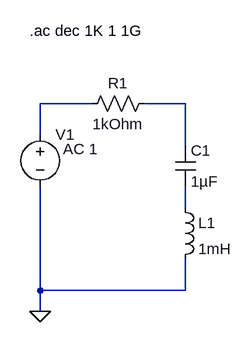
[diagram p0: schematic Draft1.asc]
Draft1.asc, the LTspice schematic file:
Version 4
SHEET 1 880 680
WIRE 288 240 208 240
WIRE 432 240 368 240
WIRE 208 288 208 240
WIRE 432 304 432 240
WIRE 432 400 432 368
WIRE 208 528 208 368
WIRE 432 528 432 480
WIRE 432 528 208 528
WIRE 208 560 208 528
FLAG 208 560 0
SYMBOL voltage 208 272 R0
WINDOW 123 35 38 Left 2
SYMATTR Value2 AC 1
SYMATTR InstName V1
SYMATTR Value ""
SYMBOL res 384 224 R90
WINDOW 0 0 56 VBottom 2
WINDOW 3 32 56 VTop 2
SYMATTR InstName R1
SYMATTR Value 1kOhm
SYMBOL cap 416 304 R0
SYMATTR InstName C1
SYMATTR Value 1µF
SYMBOL ind 416 384 R0
SYMATTR InstName L1
SYMATTR Value 1mH
TEXT 192 128 Left 2 !.ac dec 1K 1 1G

The netlist it stands for:
* Draft1.asc
V1 N001 0 AC 1
R1 N002 N001 1kOhm
C1 N002 N003 1µF
L1 N003 0 1mH
.ac dec 1K 1 1G
.backanno
.end